# Altium schematic sheet 7seg.SchDoc
size A4; SheetNumber: 3; SheetTotal: 4
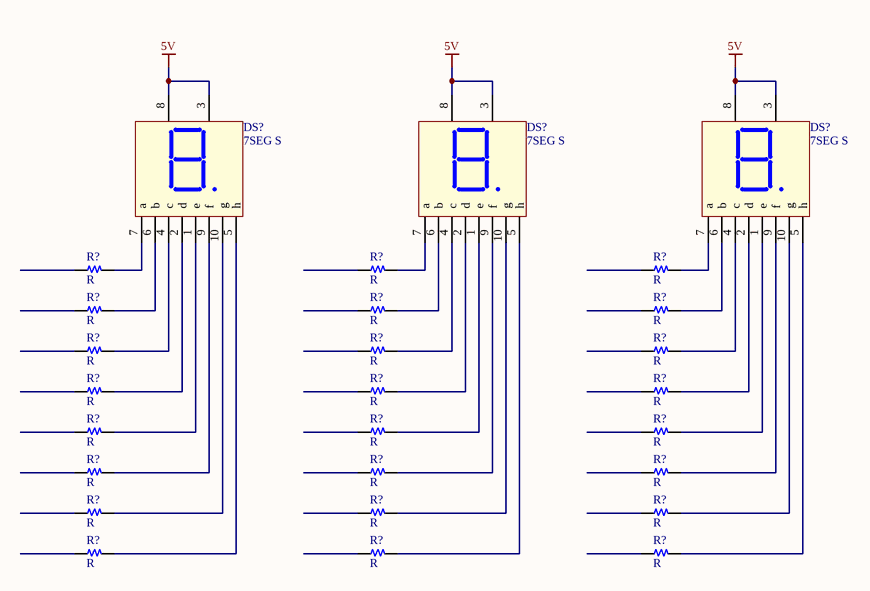
[diagram p0: 7seg.SchDoc]

## Parts
(Parts that share a designator on the sheet are numbered #1, #2 ... from top to bottom, then left to right.)
DS?#1  7SEG S  [7SEGS]
DS?#2  7SEG S  [7SEGS]
DS?#3  7SEG S  [7SEGS]
R?#1  R  [R 0603]
R?#2  R  [R 0603]
R?#3  R  [R 0603]
R?#4  R  [R 0603]
R?#5  R  [R 0603]
R?#6  R  [R 0603]
R?#7  R  [R 0603]
R?#8  R  [R 0603]
R?#9  R  [R 0603]
R?#10  R  [R 0603]
R?#11  R  [R 0603]
R?#12  R  [R 0603]
R?#13  R  [R 0603]
R?#14  R  [R 0603]
R?#15  R  [R 0603]
R?#16  R  [R 0603]
R?#17  R  [R 0603]
R?#18  R  [R 0603]
R?#19  R  [R 0603]
R?#20  R  [R 0603]
R?#21  R  [R 0603]
R?#22  R  [R 0603]
R?#23  R  [R 0603]
R?#24  R  [R 0603]

## Nets
5V: DS?#1.3(Vcc) DS?#1.8(Vcc) DS?#2.3(Vcc) DS?#2.8(Vcc) DS?#3.3(Vcc) DS?#3.8(Vcc)
NetDS?#1_1: DS?#1.1(e) R?#13.2
NetDS?#1_2: DS?#1.2(d) R?#10.2
NetDS?#1_4: DS?#1.4(c) R?#7.2
NetDS?#1_5: DS?#1.5(h) R?#22.2
NetDS?#1_6: DS?#1.6(b) R?#4.2
NetDS?#1_7: DS?#1.7(a) R?#1.2
NetDS?#1_9: DS?#1.9(f) R?#16.2
NetDS?#1_10: DS?#1.10(g) R?#19.2
NetDS?#2_1: DS?#2.1(e) R?#14.2
NetDS?#2_2: DS?#2.2(d) R?#11.2
NetDS?#2_4: DS?#2.4(c) R?#8.2
NetDS?#2_5: DS?#2.5(h) R?#23.2
NetDS?#2_6: DS?#2.6(b) R?#5.2
NetDS?#2_7: DS?#2.7(a) R?#2.2
NetDS?#2_9: DS?#2.9(f) R?#17.2
NetDS?#2_10: DS?#2.10(g) R?#20.2
NetDS?#3_1: DS?#3.1(e) R?#15.2
NetDS?#3_2: DS?#3.2(d) R?#12.2
NetDS?#3_4: DS?#3.4(c) R?#9.2
NetDS?#3_5: DS?#3.5(h) R?#24.2
NetDS?#3_6: DS?#3.6(b) R?#6.2
NetDS?#3_7: DS?#3.7(a) R?#3.2
NetDS?#3_9: DS?#3.9(f) R?#18.2
NetDS?#3_10: DS?#3.10(g) R?#21.2

Not connected (* = marked no-connect by the designer): R?#1 1; R?#2 1; R?#3 1; R?#4 1; R?#5 1; R?#6 1; R?#7 1; R?#8 1; R?#9 1; R?#10 1; R?#11 1; R?#12 1; R?#13 1; R?#14 1; R?#15 1; R?#16 1; R?#17 1; R?#18 1; R?#19 1; R?#20 1; R?#21 1; R?#22 1; R?#23 1; R?#24 1

## Library data of the parts
DS?#1-DS?#3 = LED 7S: Single 7 Seg Dipslay; Value: LED 7S SEG
R?#1-R?#24 = Resistor